# EAGLE design uNavMasterBoard (EAGLE 6.2)
DRAWING_AUTHOR: uNav BaseBoard
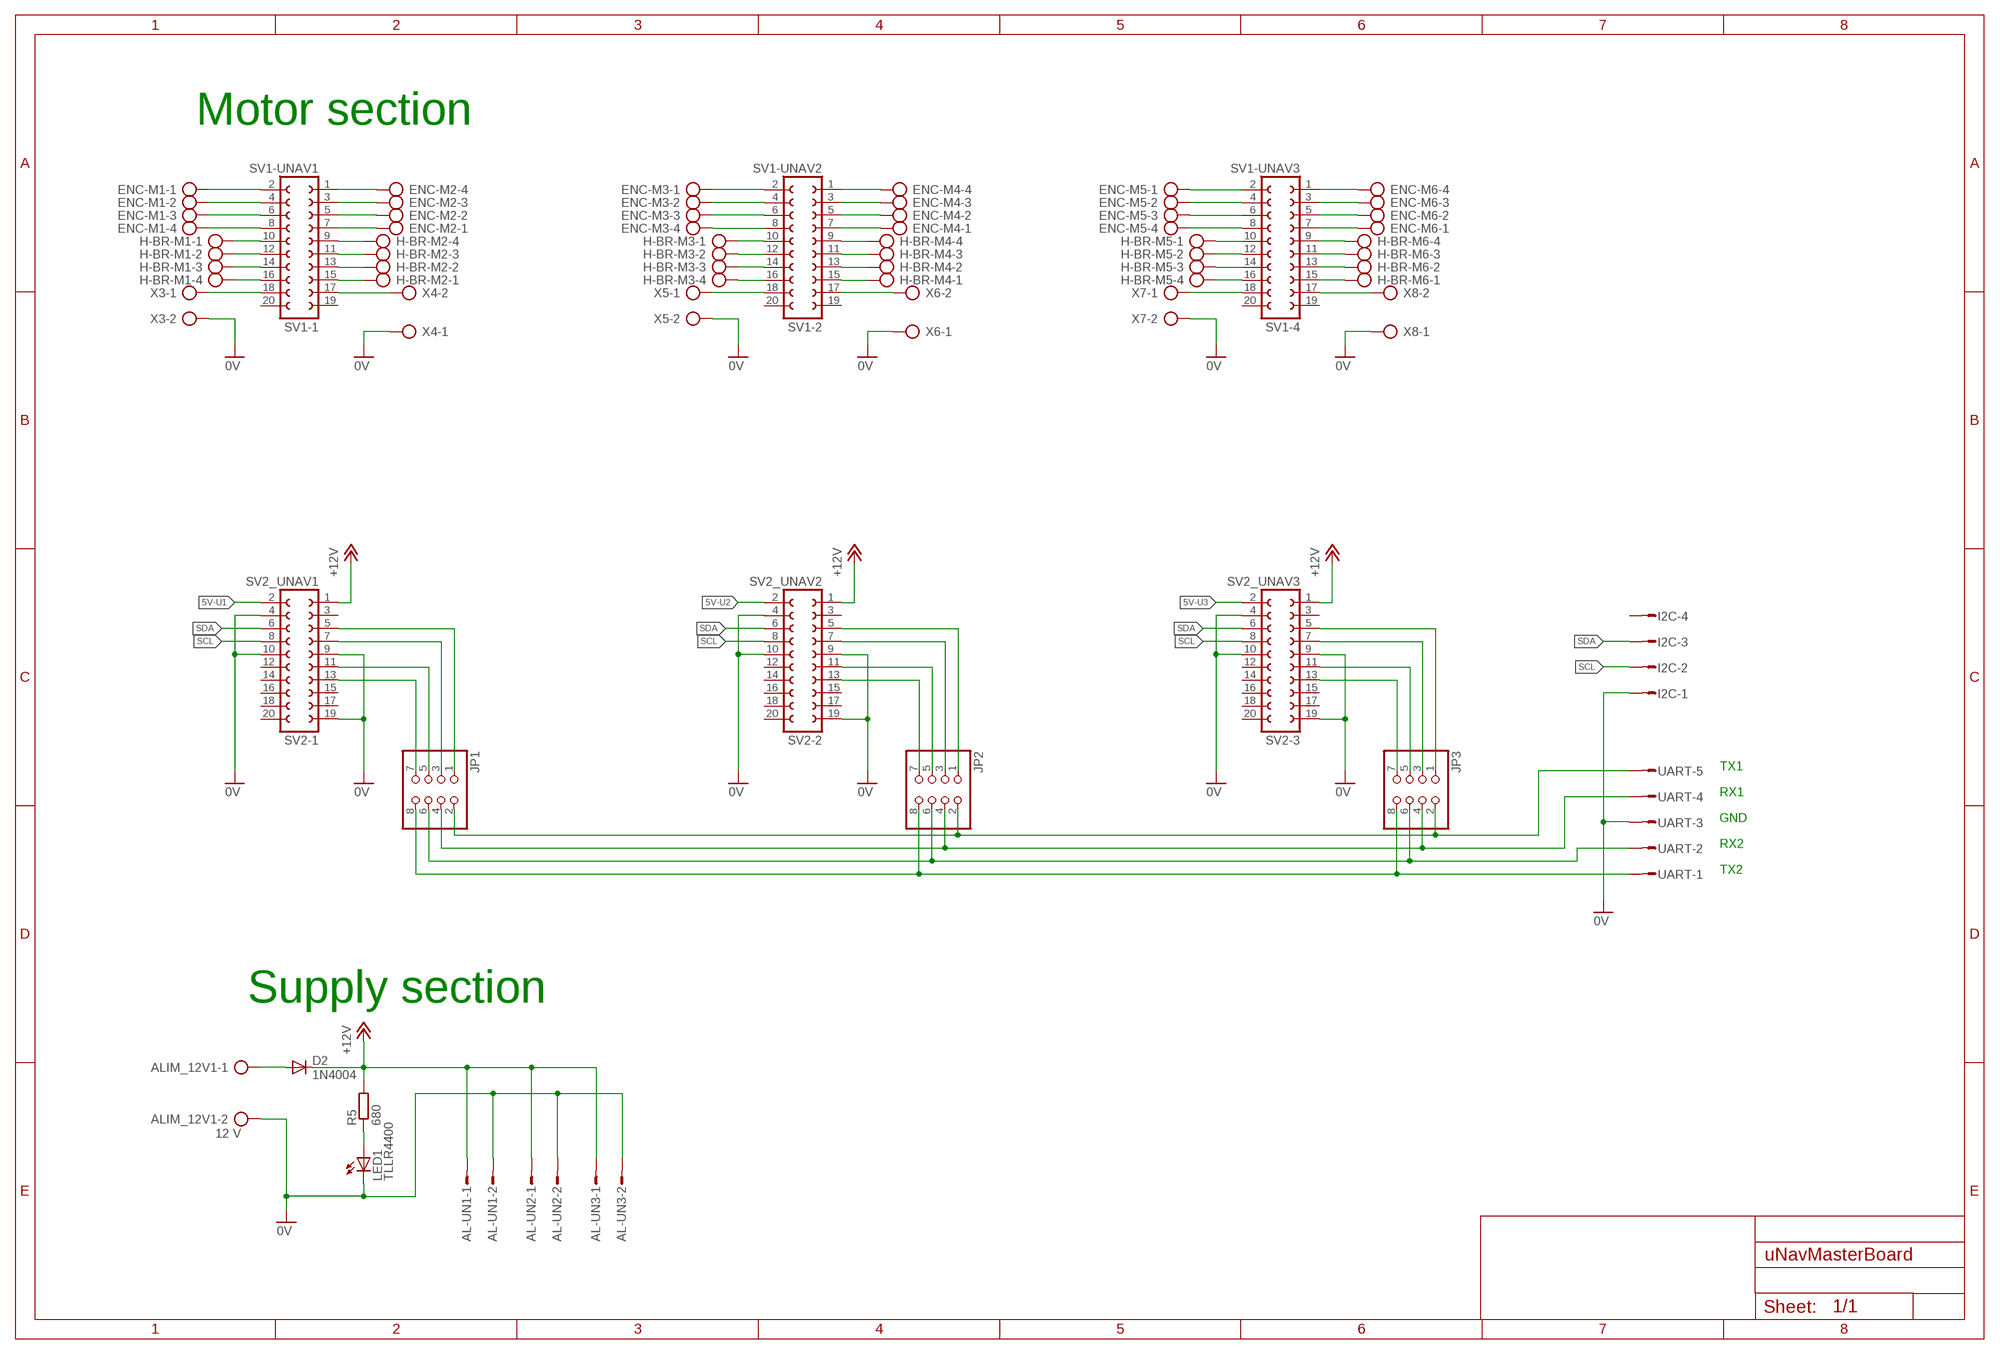
[diagram p0: schematic, sheet 1]

## Parts
AL-UN1  S02P  [S02P]
AL-UN2  S02P  [S02P]
AL-UN3  S02P  [S02P]
ALIM_12V1  12 V  AK500/2  [AK500/2]
D2  1N4004  [DO41-10]
ENC-M1  AK500/4  [AK500/4]
ENC-M2  AK500/4  [AK500/4]
ENC-M3  AK500/4  [AK500/4]
ENC-M4  AK500/4  [AK500/4]
ENC-M5  AK500/4  [AK500/4]
ENC-M6  AK500/4  [AK500/4]
H-BR-M1  AK500/4  [AK500/4]
H-BR-M2  AK500/4  [AK500/4]
H-BR-M3  AK500/4  [AK500/4]
H-BR-M4  AK500/4  [AK500/4]
H-BR-M5  AK500/4  [AK500/4]
H-BR-M6  AK500/4  [AK500/4]
I2C  S04P  [S04P]
JP1  PINHD-2X4  [2X04]
JP2  PINHD-2X4  [2X04]
JP3  PINHD-2X4  [2X04]
LED1  TLLR4400  [LED3MM]
R5  680  R-EU_0207/10  [0207/10]
SV1-1  SV1-UNAV1  FE10-2  [FE10-2]
SV1-2  SV1-UNAV2  FE10-2  [FE10-2]
SV1-4  SV1-UNAV3  FE10-2  [FE10-2]
SV2-1  SV2_UNAV1  FE10-2  [FE10-2]
SV2-2  SV2_UNAV2  FE10-2  [FE10-2]
SV2-3  SV2_UNAV3  FE10-2  [FE10-2]
UART  S05P  [S05P]
X3  AK500/2  [AK500/2]
X4  AK500/2  [AK500/2]
X5  AK500/2  [AK500/2]
X6  AK500/2  [AK500/2]
X7  AK500/2  [AK500/2]
X8  AK500/2  [AK500/2]

## Nets
0V: AL-UN1.2 AL-UN2.2 AL-UN3.2 ALIM_12V1.2 I2C.1 LED1.K(C) SV2-1.4 SV2-1.9 SV2-1.10 SV2-1.19 SV2-2.4 SV2-2.9 SV2-2.10 SV2-2.19 SV2-3.4 SV2-3.9 SV2-3.10 SV2-3.19 UART.3 X3.2 X4.1 X5.2 X6.1 X7.2 X8.1
5V-U1: SV2-1.2
5V-U2: SV2-2.2
5V-U3: SV2-3.2
+12V: AL-UN1.1 AL-UN2.1 AL-UN3.1 D2.C R5.2 SV2-1.1 SV2-2.1 SV2-3.1
N$1: ENC-M1.1 SV1-1.2
N$2: ENC-M1.2 SV1-1.4
N$3: ENC-M1.3 SV1-1.6
N$4: ENC-M1.4 SV1-1.8
N$5: H-BR-M1.1 SV1-1.10
N$6: H-BR-M1.2 SV1-1.12
N$7: H-BR-M1.3 SV1-1.14
N$8: H-BR-M1.4 SV1-1.16
N$9: SV1-1.18 X3.1
N$10: ENC-M2.1 SV1-1.7
N$11: ENC-M2.2 SV1-1.5
N$12: ENC-M2.3 SV1-1.3
N$13: ENC-M2.4 SV1-1.1
N$14: H-BR-M2.4 SV1-1.9
N$15: H-BR-M2.3 SV1-1.11
N$16: H-BR-M2.2 SV1-1.13
N$17: H-BR-M2.1 SV1-1.15
N$18: SV1-1.17 X4.2
N$19: ENC-M3.1 SV1-2.2
N$20: ENC-M3.2 SV1-2.4
N$21: ENC-M4.4 SV1-2.1
N$22: ENC-M4.3 SV1-2.3
N$23: ENC-M4.2 SV1-2.5
N$24: ENC-M4.1 SV1-2.7
N$25: JP1.1 SV2-1.5
N$26: JP1.3 SV2-1.7
N$27: JP1.5 SV2-1.11
N$28: H-BR-M4.4 SV1-2.9
N$29: JP1.7 SV2-1.13
N$30: JP2.1 SV2-2.5
N$31: H-BR-M4.3 SV1-2.11
N$32: H-BR-M4.2 SV1-2.13
N$33: H-BR-M4.1 SV1-2.15
N$34: SV1-2.17 X6.2
N$35: SV1-2.18 X5.1
N$36: H-BR-M3.4 SV1-2.16
N$37: H-BR-M3.3 SV1-2.14
N$38: H-BR-M3.2 SV1-2.12
N$39: H-BR-M3.1 SV1-2.10
N$40: ENC-M3.4 SV1-2.8
N$41: ENC-M3.3 SV1-2.6
N$42: ENC-M5.1 SV1-4.2
N$43: ENC-M5.2 SV1-4.4
N$44: ENC-M5.3 SV1-4.6
N$45: ENC-M5.4 SV1-4.8
N$46: H-BR-M5.1 SV1-4.10
N$47: H-BR-M5.2 SV1-4.12
N$48: H-BR-M5.3 SV1-4.14
N$49: H-BR-M5.4 SV1-4.16
N$50: SV1-4.18 X7.1
N$51: SV1-4.17 X8.2
N$52: H-BR-M6.4 SV1-4.9
N$53: H-BR-M6.3 SV1-4.11
N$54: H-BR-M6.2 SV1-4.13
N$55: H-BR-M6.1 SV1-4.15
N$56: ENC-M6.4 SV1-4.1
N$57: ENC-M6.3 SV1-4.3
N$58: ENC-M6.2 SV1-4.5
N$59: ENC-M6.1 SV1-4.7
N$60: JP2.3 SV2-2.7
N$61: ALIM_12V1.1 D2.A
N$62: JP2.5 SV2-2.11
N$63: LED1.A R5.1
N$67: JP2.7 SV2-2.13
N$68: JP3.1 SV2-3.5
N$69: JP3.3 SV2-3.7
N$70: JP3.5 SV2-3.11
N$71: JP3.7 SV2-3.13
N$72: JP1.2 JP2.2 JP3.2 UART.5
N$73: JP1.4 JP2.4 JP3.4 UART.4
N$74: JP1.6 JP2.6 JP3.6 UART.2
N$75: JP1.8 JP2.8 JP3.8 UART.1
SCL: I2C.2 SV2-1.8 SV2-2.8 SV2-3.8
SDA: I2C.3 SV2-1.6 SV2-2.6 SV2-3.6
Unconnected: I2C.4 SV1-1.19 SV1-1.20 SV1-2.19 SV1-2.20 SV1-4.19 SV1-4.20 SV2-1.3 SV2-1.12 SV2-1.14 SV2-1.15 SV2-1.16 SV2-1.17 SV2-1.18 SV2-1.20 SV2-2.3 SV2-2.12 SV2-2.14 SV2-2.15 SV2-2.16 SV2-2.17 SV2-2.18 SV2-2.20 SV2-3.3 SV2-3.12 SV2-3.14 SV2-3.15 SV2-3.16 SV2-3.17 SV2-3.18 SV2-3.20

## Notes on the sheet
- Motor section
- TX1
- RX1
- GND
- RX2
- TX2
- Supply section

## Library data of the parts
AL-UN1-AL-UN3 = con-amp-mt:S02P: AMP MT CONNECTOR; OC_FARNELL: unknown; OC_NEWARK: unknown
ALIM_12V1 X3-X8 = con-ptr500:AK500/2: CONNECTOR; OC_FARNELL: unknown; OC_NEWARK: unknown
D2 = diode:1N4004: DIODE general purpose rectifier, 1 A
ENC-M1-ENC-M6 H-BR-M1-H-BR-M6 = con-ptr500:AK500/4: CONNECTOR; OC_FARNELL: unknown; OC_NEWARK: unknown
I2C = con-amp-mt:S04P: AMP MT CONNECTOR; OC_FARNELL: unknown; OC_NEWARK: unknown
JP1-JP3 = pinhead:PINHD-2X4: PIN HEADER
LED1 = led:TLLR4400: Low Current (2mA) LED 3 mm Tinted Diffused Package color RED Source: Data sheet <http://www.farnell.com/datasheets/391100.pdf>; MF: VISHAY SEMICONDUCTOR; OC_FARNELL: 1612437
R5 = rcl:R-EU_: RESISTOR, European symbol
SV1-1 SV1-2 SV1-4 SV2-1-SV2-3 = con-lsta:FE10-2: FEMALE HEADER; OC_FARNELL: unknown; OC_NEWARK: unknown
UART = con-amp-mt:S05P: AMP MT CONNECTOR; OC_FARNELL: unknown; OC_NEWARK: unknown

## Board
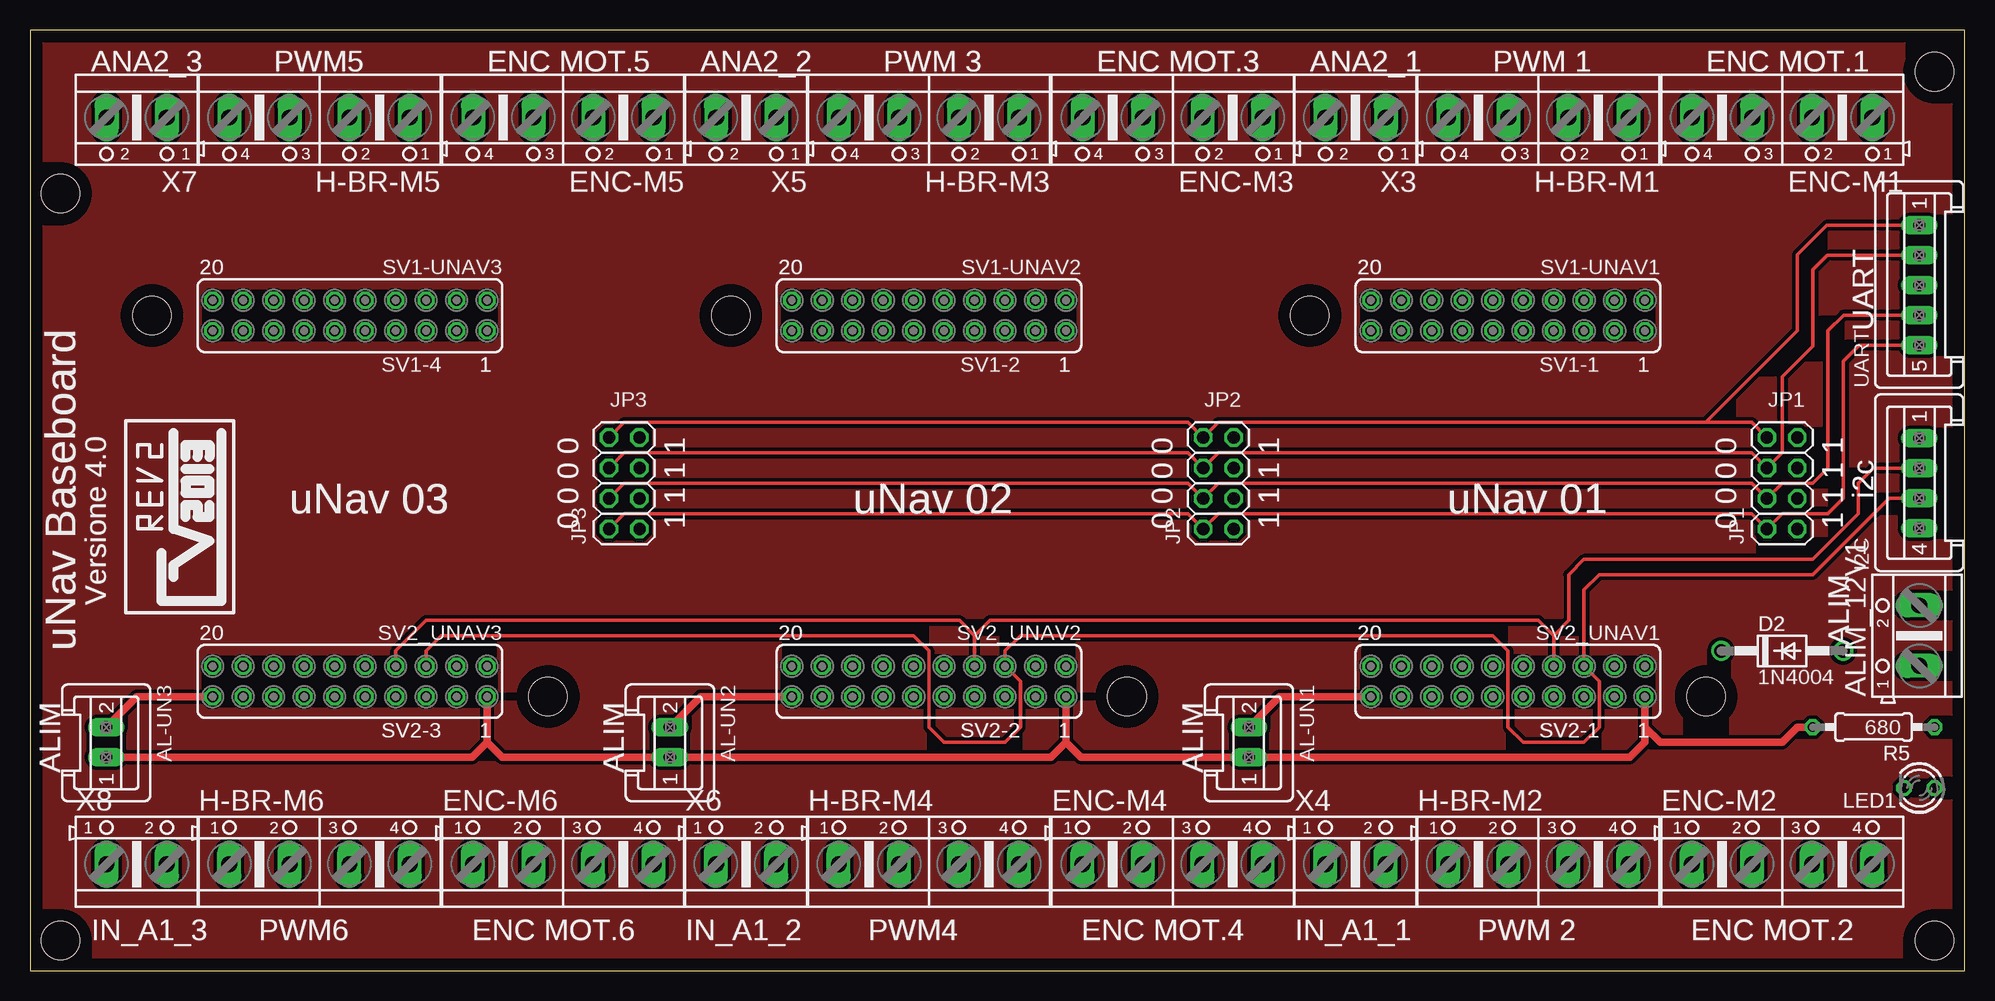
[diagram p1: board, top side]
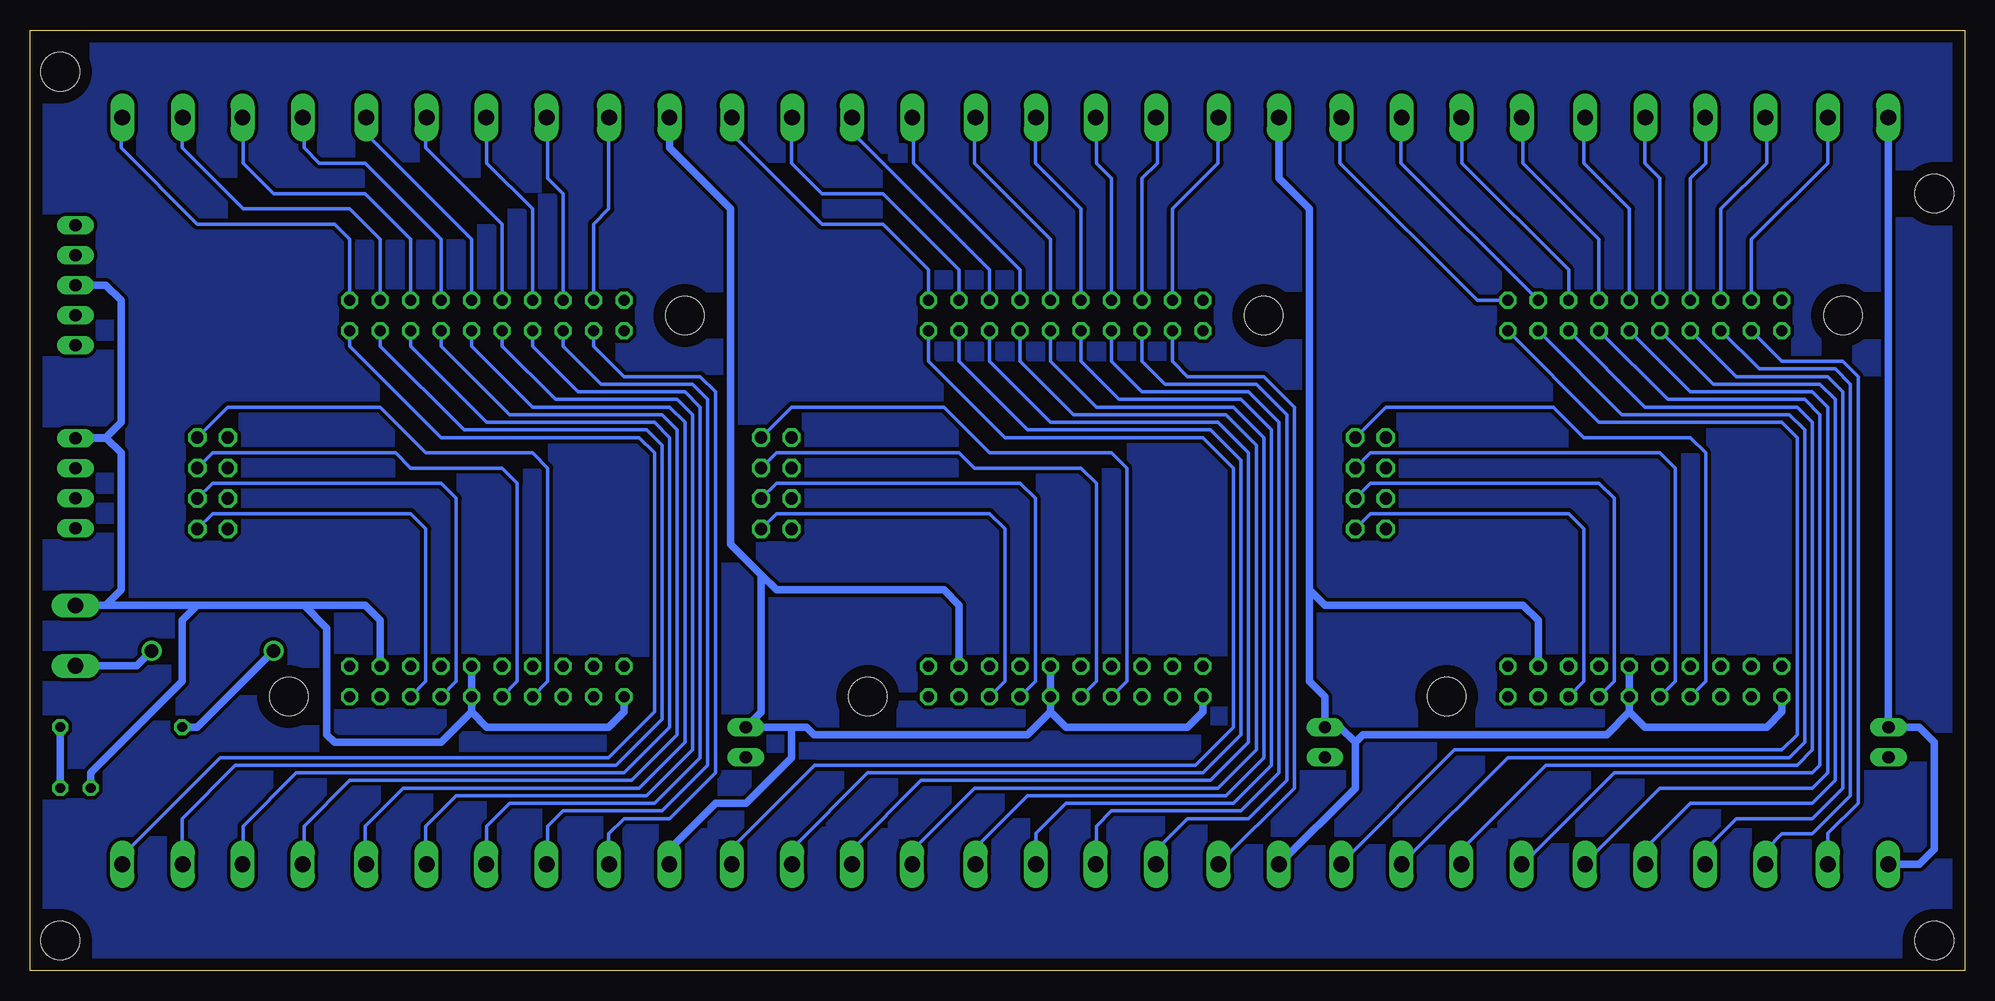
[diagram p2: board, bottom side, seen from below]

Size 161.27 x 78.41 mm. Coordinates in mm from the lower left corner, seen from the top.
Outline: 0,0 161.27,0 161.27,78.41 0,78.41 0,0
Copper layers (1*16): Top 0.035mm / dielectric 1.5mm / Bottom 0.035mm
Design rules "default": minimum track width 10mil, minimum drill 24mil, track to track 8mil, track to pad 8mil, pad to pad 8mil, via to via 8mil, smd to smd 8mil, copper to edge 40mil, drill to drill 8mil, minimum pad ring 10mil, minimum via ring 8mil, stop-mask expansion 4mil, vias tented up to drill 0mil, thermal gap 10mil
Holes 3.2 mm at 2.54,2.54 158.75,2.54 2.54,64.77 158.75,74.93 10.16,54.61 43.18,22.86 58.42,54.61 91.44,22.86 106.68,54.61 139.7,22.86

### Footprints (pad centres in the part's own frame; a part is rotated, then mirrored left to right if it is on the bottom)
S02P = drill 1.016 long: 1 1.25,0; 2 -1.25,0
AK500/2 = drill 1.321 long: 1 -2.515,0; 2 2.515,0
DO41-10 = drill 1.118: A 5.08,0; C -5.08,0
AK500/4 = drill 1.321 long: 1 -7.518,0; 2 -2.489,0; 3 2.489,0; 4 7.518,0
S04P = drill 1.016 long: 1 3.75,0; 2 1.25,0; 3 -1.25,0; 4 -3.75,0
2X04 = drill 1.016 octagon: 1 -3.81,-1.27; 2 -3.81,1.27; 3 -1.27,-1.27; 4 -1.27,1.27; 5 1.27,-1.27; 6 1.27,1.27; 7 3.81,-1.27; 8 3.81,1.27
LED3MM = drill 0.813 octagon: A -1.27,0; K 1.27,0
0207/10 = drill 0.813 octagon: 1 -5.08,0; 2 5.08,0
FE10-2 = drill 0.914 octagon: 1 -11.43,1.27; 2 -11.43,-1.27; 3 -8.89,1.27; 4 -8.89,-1.27; 5 -6.35,1.27; 6 -6.35,-1.27; 7 -3.81,1.27; 8 -3.81,-1.27; 9 -1.27,1.27; 10 -1.27,-1.27; 11 1.27,1.27; 12 1.27,-1.27; 13 3.81,1.27; 14 3.81,-1.27; 15 6.35,1.27; 16 6.35,-1.27; 17 8.89,1.27; 18 8.89,-1.27; 19 11.43,1.27; 20 11.43,-1.27
S05P = drill 1.016 long: 1 5,0; 2 2.5,0; 3 0,0; 4 -2.5,0; 5 -5,0

### Placement (x,y rotation side)
AL-UN1  101.6,19.05 270 top
AL-UN2  53.34,19.05 270 top
AL-UN3  6.35,19.05 270 top
ALIM_12V1  157.48,27.94 90 top
D2  146.05,26.67 0 top
ENC-M1  146.05,71.12 180 top
ENC-M2  146.05,8.89 0 top
ENC-M3  95.25,71.12 180 top
ENC-M4  95.25,8.89 0 top
ENC-M5  44.45,71.12 180 top
ENC-M6  44.45,8.89 0 top
H-BR-M1  125.73,71.12 180 top
H-BR-M2  125.73,8.89 0 top
H-BR-M3  74.93,71.12 180 top
H-BR-M4  74.93,8.89 0 top
H-BR-M5  24.13,71.12 180 top
H-BR-M6  24.13,8.89 0 top
I2C  157.48,40.64 90 top
JP1  146.05,40.64 90 top
JP2  99.06,40.64 90 top
JP3  49.53,40.64 90 top
LED1  157.48,15.24 180 top
R5  153.67,20.32 180 top
SV1-1  123.19,54.61 180 top
SV1-2  74.93,54.61 180 top
SV1-4  26.67,54.61 180 top
SV2-1  123.19,24.13 180 top
SV2-2  74.93,24.13 180 top
SV2-3  26.67,24.13 180 top
U$1  [LOGO_TOP]  13.97,36.83 90 top
UART  157.48,57.15 90 top
X3  110.49,71.12 180 top
X4  110.49,8.89 0 top
X5  59.69,71.12 180 top
X6  59.69,8.89 0 top
X7  8.89,71.12 180 top
X8  8.89,8.89 0 top

### Tracks (layer width: path | path; a pad name or v marks a point on that pad's centre or on a via)
0V
  Top 0.61: SV2-3.19 8.91,22.86 AL-UN3.2 | SV2-2.19 55.9,22.86 AL-UN2.2 | SV2-1.19 104.16,22.86 AL-UN1.2
  Bottom 0.61: X8.1 3.81,8.89 2.54,10.16 2.54,19.05 3.81,20.32 6.33,20.32 AL-UN3.2 6.38,20.33 X7.2 | SV2-3.19 15.24,21.59 16.51,20.32 26.67,20.32 27.94,21.59 | 27.94,21.59 SV2-3.9 SV2-3.10 | 27.94,21.59 29.84,19.69 50.16,19.69 50.8,19.05 | X6.1 57.15,8.89 50.8,15.24 50.8,19.05 | 50.8,19.05 52.07,20.32 54.59,20.32 AL-UN2.2 53.34,22.86 54.61,24.13 54.61,31.75 | X5.2 57.17,66.06 54.61,63.5 54.61,31.75 | SV2-2.19 63.5,21.59 64.77,20.32 74.93,20.32 76.2,21.59 | 76.2,21.59 SV2-2.9 SV2-2.10 | 97.79,20.3 AL-UN1.2 100.33,21.57 100.33,33.02 | 97.79,20.3 96.52,20.3 95.91,19.69 78.1,19.69 76.2,21.59 | X3.2 107.97,68.61 102.87,63.5 102.87,35.56 100.33,33.02 | X4.1 107.97,10.13 104.14,13.97 101.6,13.97 97.79,17.78 97.79,20.3 | SV2-1.19 111.76,21.59 113.03,20.32 123.19,20.32 124.46,21.59 | 124.46,21.59 SV2-1.9 SV2-1.10 | SV2-1.4 132.08,29.21 133.35,30.48 138.43,30.48 | 147.32,30.48 154.94,30.48 | ALIM_12V1.2 157.45,30.48 154.94,30.48 | LED1.K 156.21,16.51 148.59,24.13 148.59,29.21 147.32,30.48 | 154.94,30.48 153.67,31.75 153.67,43.18 154.94,44.45 157.42,44.45 I2C.1 155,44.39 153.67,45.72 153.67,55.88 154.94,57.15 UART.3 | 147.32,30.48 138.43,30.48 | 138.43,30.48 136.53,28.58 136.53,19.69 135.89,19.05 127,19.05 124.46,21.59 | SV2-2.4 83.82,30.48 85.09,31.75 99.06,31.75 100.33,33.02 | SV2-3.4 35.56,29.21 36.83,30.48 53.34,30.48 54.61,31.75
+12V
  Top 0.61: AL-UN3.1 36.85,17.8 38.1,19.05 | 38.1,19.05 SV2-3.1 | 38.1,19.05 39.35,17.8 AL-UN2.1 85.11,17.8 86.36,19.05 | 86.36,19.05 SV2-2.1 | 86.36,19.05 87.61,17.8 AL-UN1.1 133.37,17.8 134.62,19.05 SV2-1.1 134.62,20.32 135.89,19.05 146.05,19.05 147.32,20.32 R5.2
  Bottom 0.61: R5.2 147.32,20.32 D2.C
GND
  pour Top (isolate 0.305): 0,78.74 161.29,78.74 161.29,0 0,0
  pour Bottom (isolate 0.305): 0,78.74 161.29,78.74 161.29,0 0,0
N$1
  Bottom 0.305: SV1-1.2 134.62,60.96 135.89,62.23 147.32,62.23 153.67,68.58 153.67,71.02 ENC-M1.1
N$2
  Bottom 0.305: SV1-1.4 132.08,60.96 134.62,63.5 143.51,63.5 148.59,68.58 148.59,71.07 ENC-M1.2
N$3
  Bottom 0.305: SV1-1.6 129.54,60.96 133.35,64.77 140.97,64.77 143.51,67.31 143.51,71.07 ENC-M1.3
N$4
  Bottom 0.305: SV1-1.8 127,60.96 133.35,67.31 137.16,67.31 138.43,68.58 138.43,71.02 ENC-M1.4
N$5
  Bottom 0.305: SV1-1.10 124.46,60.96 133.35,69.85 133.35,71.02 H-BR-M1.1
N$6
  Bottom 0.305: SV1-1.12 121.92,62.23 128.27,68.58 128.27,71.07 H-BR-M1.2
N$7
  Bottom 0.305: SV1-1.14 119.38,63.5 123.19,67.31 123.19,71.07 H-BR-M1.3
N$8
  Bottom 0.305: SV1-1.16 116.84,64.77 118.11,66.04 118.11,71.02 H-BR-M1.4
N$9
  Bottom 0.305: 113,71.09 X3.1 113.03,71.09 113.03,63.5 114.3,62.23 SV1-1.18
N$10
  Bottom 0.305: SV1-1.7 127,52.07 121.28,46.36 108.59,46.36 107.31,45.09 107.31,19.69 111.12,15.88 134.62,15.88 138.43,12.06 138.43,8.99 ENC-M2.1
N$11
  Bottom 0.305: SV1-1.5 129.54,52.07 123.19,45.72 109.22,45.72 107.95,44.45 107.95,20.32 111.76,16.51 139.06,16.51 143.51,12.06 143.51,8.94 ENC-M2.2
N$12
  Bottom 0.305: SV1-1.3 132.08,52.07 125.09,45.09 109.85,45.09 108.59,43.81 108.59,20.95 112.4,17.15 144.15,17.15 148.59,12.7 148.59,8.94 ENC-M2.3
N$13
  Bottom 0.305: SV1-1.1 134.62,52.07 127,44.45 110.49,44.45 109.22,43.18 109.22,21.59 113.03,17.78 145.41,17.78 153.67,9.52 153.67,8.99 ENC-M2.4
N$14
  Bottom 0.305: SV1-1.9 124.46,52.07 119.38,46.99 107.95,46.99 106.68,45.72 106.68,19.05 110.49,15.24 130.18,15.24 133.35,12.06 133.35,8.99 H-BR-M2.4
N$15
  Bottom 0.305: SV1-1.11 121.92,52.07 117.47,47.62 107.31,47.62 106.04,46.36 106.04,18.42 109.85,14.61 125.73,14.61 128.27,12.06 128.27,8.94 H-BR-M2.3
N$16
  Bottom 0.305: SV1-1.13 119.38,52.07 115.57,48.26 106.68,48.26 105.41,46.99 105.41,17.78 109.22,13.97 121.28,13.97 123.19,12.06 123.19,8.94 H-BR-M2.2
N$17
  Bottom 0.305: SV1-1.15 116.84,52.07 113.66,48.89 106.04,48.89 104.78,47.62 104.78,17.15 108.59,13.34 116.84,13.34 118.11,12.06 118.11,8.99 H-BR-M2.1
N$18
  Bottom 0.305: SV1-1.17 114.3,52.07 111.76,49.53 105.41,49.53 104.14,48.26 104.14,16.51 107.95,12.7 111.76,12.7 113.03,11.43 113.03,8.91 X4.2
N$19
  Bottom 0.305: SV1-2.2 86.36,58.42 90.17,62.23 95.25,62.23 102.87,69.85 102.87,71.02 ENC-M3.1
N$20
  Bottom 0.305: SV1-2.4 83.82,58.42 90.17,64.77 95.25,64.77 97.79,67.31 97.79,71.07 ENC-M3.2
N$21
  Bottom 0.305: ENC-M4.4 102.77,10.26 95.88,17.15 64.13,17.15 60.96,20.32 60.96,41.91 63.5,44.45 80.01,44.45 86.36,50.8 SV1-2.1
N$22
  Bottom 0.305: SV1-2.3 83.82,50.8 78.1,45.09 62.87,45.09 60.33,42.55 60.33,19.69 63.5,16.51 91.44,16.51 97.79,10.16 97.79,8.94 ENC-M4.3
N$23
  Bottom 0.305: SV1-2.5 81.28,50.8 76.2,45.72 62.23,45.72 59.69,43.18 59.69,19.05 62.87,15.88 87,15.88 92.76,10.11 ENC-M4.2
N$24
  Bottom 0.305: SV1-2.7 78.74,50.8 74.3,46.36 61.59,46.36 59.05,43.81 59.05,18.42 62.23,15.24 82.55,15.24 87.63,10.16 87.63,8.99 ENC-M4.1
N$25
  Bottom 0.305: SV2-1.5 128.27,24.13 128.27,36.83 129.54,38.1 146.05,38.1 JP1.1
N$26
  Bottom 0.305: SV2-1.7 125.73,24.13 125.73,39.37 127,40.64 146.05,40.64 JP1.3
N$27
  Bottom 0.305: SV2-1.11 120.65,24.13 120.65,40.64 121.92,41.91 129.54,41.91 130.81,43.18 146.05,43.18 JP1.5
N$28
  Bottom 0.305: SV1-2.9 76.2,50.8 72.39,46.99 60.96,46.99 58.42,44.45 58.42,17.78 61.59,14.61 78.1,14.61 82.45,10.26 H-BR-M4.4
N$29
  Bottom 0.305: SV2-1.13 118.11,24.13 118.11,41.91 119.38,43.18 128.27,43.18 132.08,46.99 144.78,46.99 JP1.7
N$30
  Bottom 0.305: SV2-2.5 80.01,24.13 80.01,36.83 81.28,38.1 99.06,38.1 JP2.1
N$31
  Bottom 0.305: SV1-2.11 73.66,50.8 70.48,47.62 60.33,47.62 57.79,45.09 57.79,17.15 60.96,13.97 74.93,13.97 77.42,11.48 H-BR-M4.3
N$32
  Bottom 0.305: SV1-2.13 71.12,50.8 68.58,48.26 59.69,48.26 57.15,45.72 57.15,16.51 60.33,13.34 71.12,13.34 72.39,12.06 72.39,8.94 H-BR-M4.2
N$33
  Bottom 0.305: H-BR-M4.1 67.41,10.06 64.77,12.7 59.69,12.7 56.52,15.88 56.52,46.36 59.05,48.89 66.67,48.89 68.58,50.8 SV1-2.15
N$34
  Bottom 0.305: X6.2 62.2,8.91 55.88,15.24 55.88,46.99 58.42,49.53 64.77,49.53 66.04,50.8 SV1-2.17
N$35
  Bottom 0.305: SV1-2.18 66.04,63.5 62.23,67.31 62.23,71.09 X5.1
N$36
  Bottom 0.305: SV1-2.16 68.58,66.04 67.31,67.31 67.31,71.02 H-BR-M3.4
N$37
  Bottom 0.305: SV1-2.14 71.12,66.04 72.39,67.31 72.39,71.07 H-BR-M3.3
N$38
  Bottom 0.305: SV1-2.12 73.66,63.5 77.47,67.31 77.47,71.07 H-BR-M3.2
N$39
  Bottom 0.305: SV1-2.10 76.2,60.96 82.55,67.31 82.55,71.02 H-BR-M3.1
N$40
  Bottom 0.305: SV1-2.8 78.74,58.42 87.63,67.31 87.63,71.02 ENC-M3.4
N$41
  Bottom 0.305: SV1-2.6 81.28,58.42 92.71,69.85 92.71,71.07 ENC-M3.3
N$42
  Bottom 0.305: SV1-4.2 40.64,55.88 52.07,67.31 52.07,71.02 ENC-M5.1
N$43
  Bottom 0.305: SV1-4.4 46.99,67.31 46.99,71.07 ENC-M5.2
N$44
  Bottom 0.305: SV1-4.6 33.02,58.42 41.91,67.31 41.91,71.12 ENC-M5.3
N$45
  Bottom 0.305: SV1-4.8 30.48,60.96 36.83,67.31 36.83,71.02 ENC-M5.4
N$46
  Bottom 0.305: SV1-4.10 27.94,63.5 31.75,67.31 31.75,71.02 H-BR-M5.1
N$47
  Bottom 0.305: SV1-4.12 25.4,66.04 26.67,67.31 26.67,71.07 H-BR-M5.2
N$48
  Bottom 0.305: SV1-4.14 22.86,66.04 21.59,67.31 21.59,71.07 H-BR-M5.3
N$49
  Bottom 0.305: SV1-4.16 20.32,63.5 16.51,67.31 16.51,71.02 H-BR-M5.4
N$50
  Bottom 0.305: SV1-4.18 17.78,60.96 11.43,67.31 11.43,71.09 X7.1
N$51
  Bottom 0.305: X8.2 11.41,11.45 8.89,13.97 8.89,49.53 10.16,50.8 15.24,50.8 SV1-4.17
N$52
  Bottom 0.305: H-BR-M6.4 31.65,8.99 25.4,15.24 12.7,15.24 11.43,16.51 11.43,46.99 12.7,48.26 22.86,48.26 SV1-4.9
N$53
  Bottom 0.305: H-BR-M6.3 26.62,10.21 22.86,13.97 12.7,13.97 10.79,15.88 10.79,47.62 12.06,48.89 20.96,48.89 SV1-4.11
N$54
  Bottom 0.305: H-BR-M6.2 21.64,10.11 19.05,12.7 12.7,12.7 10.16,15.24 10.16,48.26 11.43,49.53 19.05,49.53 SV1-4.13
N$55
  Bottom 0.305: 16.51,8.89 H-BR-M6.1 16.51,8.99 16.51,10.16 15.24,11.43 12.7,11.43 9.53,14.61 9.53,48.89 10.79,50.17 17.14,50.17 SV1-4.15
N$56
  Bottom 0.305: ENC-M6.4 51.97,8.99 42.55,18.42 15.24,18.42 13.97,19.69 13.97,44.45 15.24,45.72 30.48,45.72 SV1-4.1
N$57
  Bottom 0.305: ENC-M6.3 46.94,8.94 38.1,17.78 14.61,17.78 13.34,19.05 13.34,45.09 14.61,46.36 28.58,46.36 SV1-4.3
N$58
  Bottom 0.305: ENC-M6.2 41.96,10.11 34.92,17.15 13.97,17.15 12.7,18.42 12.7,45.72 13.97,46.99 26.67,46.99 SV1-4.5
N$59
  Bottom 0.305: ENC-M6.1 36.83,8.89 29.21,16.51 12.7,16.51 12.06,17.15 12.06,46.36 13.34,47.62 24.77,47.62 SV1-4.7
N$60
  Bottom 0.305: SV2-2.7 77.47,24.13 77.47,39.37 78.74,40.64 99.06,40.64 JP2.3
N$61
  Bottom 0.61: ALIM_12V1.1 152.38,25.42 D2.A
N$62
  Bottom 0.305: SV2-2.11 72.39,24.13 72.39,40.64 73.66,41.91 82.55,41.91 83.82,43.18 99.06,43.18 JP2.5
N$63
  Bottom 0.61: R5.1 LED1.A
N$67
  Bottom 0.305: SV2-2.13 69.85,24.13 69.85,41.91 71.12,43.18 81.28,43.18 85.09,46.99 97.79,46.99 JP2.7
N$68
  Bottom 0.305: SV2-3.5 31.75,24.13 31.75,36.83 33.02,38.1 49.53,38.1 JP3.1
N$69
  Bottom 0.305: JP3.3 49.53,40.64 30.48,40.64 29.21,39.37 29.21,24.13 SV2-3.7
N$70
  Bottom 0.305: JP3.5 49.53,43.18 25.4,43.18 24.13,41.91 24.13,24.13 SV2-3.11
N$71
  Bottom 0.305: SV2-3.13 21.59,24.13 21.59,43.18 22.86,44.45 31.75,44.45 34.29,46.99 48.26,46.99 JP3.7
N$72
  Top 0.305: JP3.2 49.53,38.1 96.52,38.1 JP2.2 99.06,38.1 143.51,38.1 JP1.2 146.05,38.1 149.86,38.1 151.13,39.37 151.13,50.8 152.48,52.15 UART.5
N$73
  Top 0.305: JP3.4 49.53,40.64 96.52,40.64 JP2.4 99.06,40.64 143.51,40.64 JP1.4 146.05,40.64 148.59,40.64 149.86,41.91 149.86,53.34 151.17,54.65 UART.4
N$74
  Top 0.305: JP3.6 49.53,43.18 96.52,43.18 JP2.6 99.06,43.18 143.51,43.18 JP1.6 146.05,43.18 146.05,49.53 148.59,52.07 148.59,58.42 149.82,59.65 UART.2
N$75
  Top 0.305: JP3.8 49.53,45.72 96.52,45.72 JP2.8 99.06,45.72 139.7,45.72 | 139.7,45.72 143.51,45.72 JP1.8 | UART.1 149.78,62.15 147.32,59.69 147.32,53.34 139.7,45.72
SCL
  Top 0.305: SV2-3.8 30.48,26.67 33.02,29.21 77.47,29.21 78.74,27.94 | SV2-2.8 78.74,27.94 | 78.74,27.94 80.01,29.21 125.73,29.21 127,27.94 | 127,27.94 SV2-1.8 | I2C.2 153.65,41.89 152.4,40.64 152.4,38.1 148.59,34.29 129.54,34.29 128.27,33.02 128.27,29.21 127,27.94
SDA
  Top 0.305: SV2-3.6 33.02,26.67 34.29,27.94 73.66,27.94 74.93,26.67 74.93,20.32 76.2,19.05 81.28,19.05 82.55,20.32 82.55,24.13 SV2-2.6 81.28,26.67 82.55,27.94 121.92,27.94 123.19,26.67 123.19,20.32 124.46,19.05 129.54,19.05 130.81,20.32 130.81,24.13 SV2-1.6 129.54,31.75 130.81,33.02 148.59,33.02 154.96,39.39 I2C.3

### Text on the board
tPlace: ANA2_3 | PWM5 | ENC MOT.5 | ANA2_2 | PWM 3 | ENC MOT.3 | ANA2_1 | PWM 1 | ENC MOT.1 | UART | i2c | uNav 03 | uNav 02 | uNav 01 | 0 0 0 0 | 1 1 1 1 | 0 0 0 0 | 1 1 1 1 | 0 0 0 0 | 1 1 1 1 | ALIM | Versione 4.0 | uNav Baseboard | ALIM | ALIM | ALIM | IN_A1_3 | PWM6 | ENC MOT.6 | IN_A1_2 | PWM4 | ENC MOT.4 | IN_A1_1 | PWM 2 | ENC MOT.2
_tsilk: ANA2_3 | PWM5 | ENC MOT.5 | ANA2_2 | PWM 3 | ENC MOT.3 | ANA2_1 | PWM 1 | ENC MOT.1 | 2 | 1 | 4 | 3 | 2 | 1 | 4 | 3 | 2 | 1 | 2 | 1 | 4 | 3 | 2 | 1 | 4 | 3 | 2 | 1 | 2 | 1 | 4 | 3 | 2 | 1 | 4 | 3 | 2 | 1 | 1 | 20 | SV1-UNAV3 | 20 | SV1-UNAV2 | 20 | SV1-UNAV1 | UART | 1 | 1 | 1 | 5 | JP3 | JP2 | JP1 | 1 | i2c | uNav 03 | uNav 02 | uNav 01 | 0 0 0 0 | 1 1 1 1 | 0 0 0 0 | 1 1 1 1 | 0 0 0 0 | 1 1 1 1 | 4 | ALIM | Versione 4.0 | 20 | SV2_UNAV3 | 20 | SV2_UNAV2 | 20 | SV2_UNAV1 | D2 | 2 | uNav Baseboard | 1N4004 | 1 | 2 | 2 | 2 | 680 | SV2-3 | 1 | SV2-2 | 1 | SV2-1 | 1 | R5 | ALIM | 1 | ALIM | 1 | ALIM | 1 | LED1 | 1 | 2 | 1 | 2 | 3 | 4 | 1 | 2 | 3 | 4 | 1 | 2 | 1 | 2 | 3 | 4 | 1 | 2 | 3 | 4 | 1 | 2 | 1 | 2 | 3 | 4 | 1 | 2 | 3 | 4 | IN_A1_3 | PWM6 | ENC MOT.6 | IN_A1_2 | PWM4 | ENC MOT.4 | IN_A1_1 | PWM 2 | ENC MOT.2